# EAGLE design Cameras_2 (EAGLE 9.1.3)
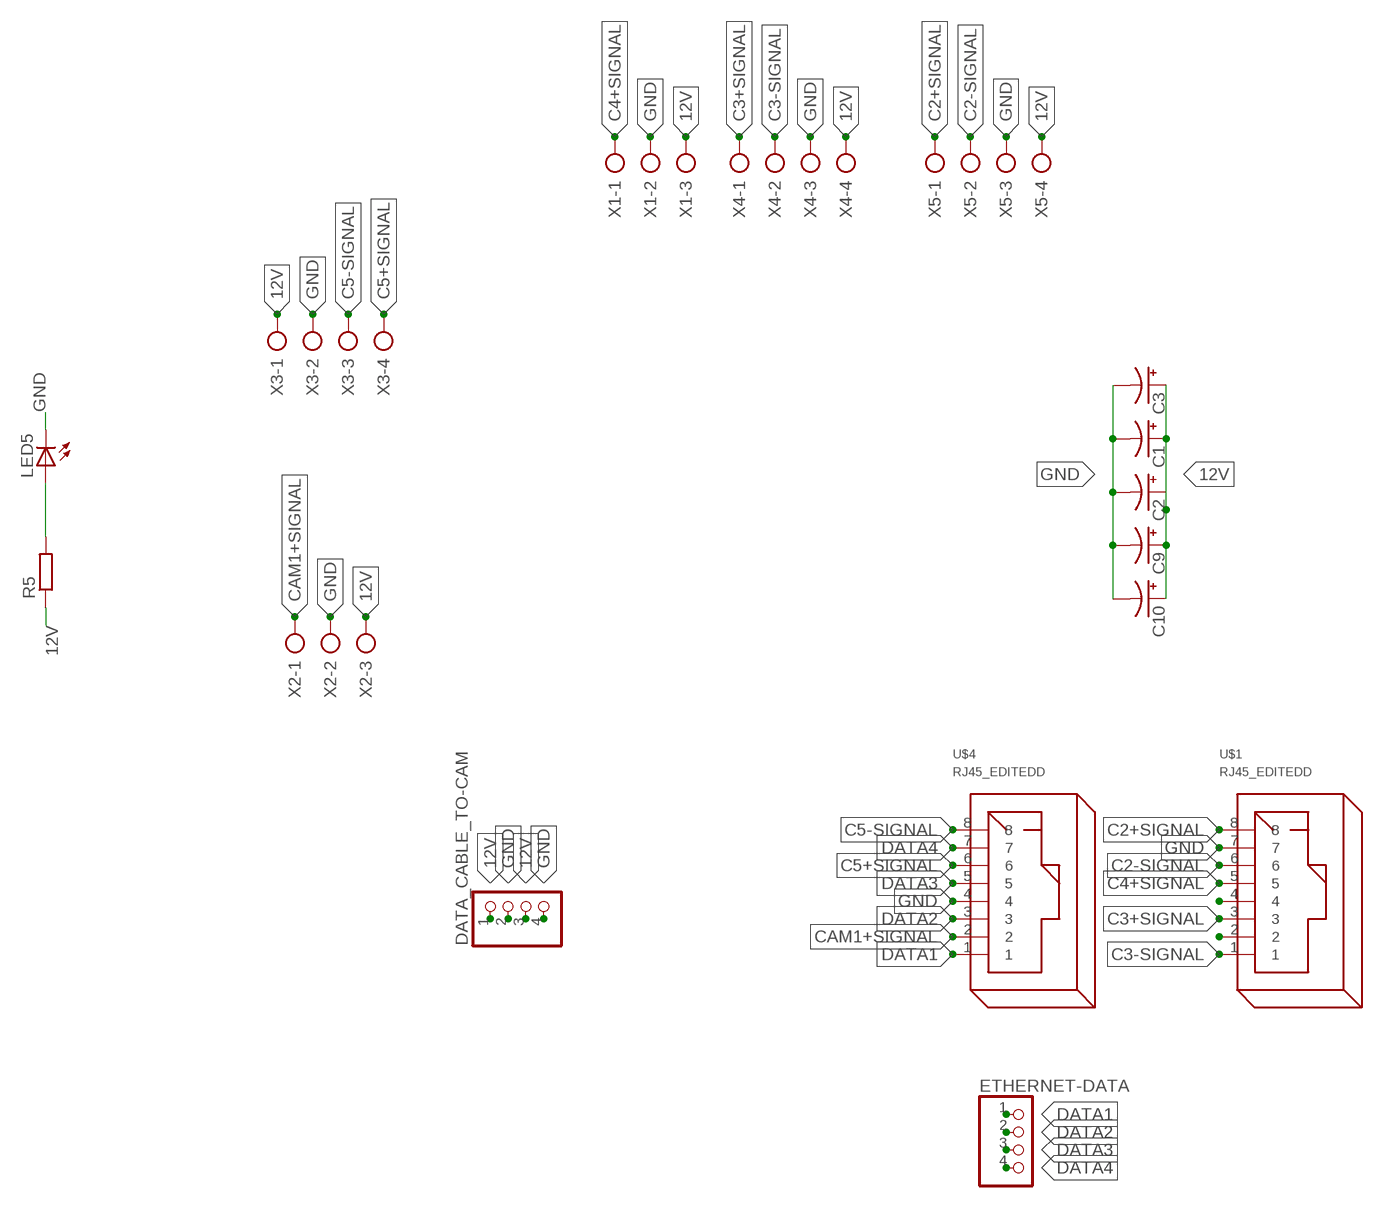
[diagram p0: schematic, sheet 1]

## Parts
C1  CPOL-USE2,5-6E  [E2,5-6E]
C2  CPOL-USE2,5-6E  [E2,5-6E]
C3  CPOL-USE2,5-6E  [E2,5-6E]
C9  CPOL-USE2,5-6E  [E2,5-6E]
C10  CPOL-USE2,5-6E  [E2,5-6E]
DATA_CABLE_TO-CAM  PINHD-1X4  [1X04]
ETHERNET-DATA  PINHD-1X4  [1X04]
LED5  LEDCHIPLED_1206  [CHIPLED_1206]
R5  R-EU_0204/7  [0204/7]
U$1  RJ45_EDITEDD  [RJ45]
U$4  RJ45_EDITEDD  [RJ45]
X1  AK300/3  [AK300/3]
X2  AK300/3  [AK300/3]
X3  AK300/4  [AK300/4]
X4  AK300/4  [AK300/4]
X5  AK300/4  [AK300/4]

## Nets
12V: C1.+ C2.+ C3.+ C9.+ C10.+ DATA_CABLE_TO-CAM.1 DATA_CABLE_TO-CAM.3 R5.1 X1.3 X2.3 X3.1 X4.4 X5.4
C2+SIGNAL: U$1.8 X5.1
C2-SIGNAL: U$1.6 X5.2
C3+SIGNAL: U$1.3 X4.1
C3-SIGNAL: U$1.1 X4.2
C4+SIGNAL: U$1.5 X1.1
C5+SIGNAL: U$4.6 X3.4
C5-SIGNAL: U$4.8 X3.3
CAM1+SIGNAL: U$4.2 X2.1
DATA1: ETHERNET-DATA.1 U$4.1
DATA2: ETHERNET-DATA.2 U$4.3
DATA3: ETHERNET-DATA.3 U$4.5
DATA4: ETHERNET-DATA.4 U$4.7
GND: C1.- C2.- C3.- C9.- C10.- DATA_CABLE_TO-CAM.2 DATA_CABLE_TO-CAM.4 LED5.C U$1.7 U$4.4 X1.2 X2.2 X3.2 X4.3 X5.3
N$10: LED5.A R5.2
N$26: U$1.4
N$28: U$1.2

## Library data of the parts
C1-C3 C9 C10 = rcl:CPOL-US: POLARIZED CAPACITOR, American symbol; SPICEPREFIX: C
DATA_CABLE_TO-CAM ETHERNET-DATA = pinhead:PINHD-1X4: PIN HEADER
LED5 = led:LED: LED OSRAM: - CHIPLED LG R971, LG N971, LY N971, LG Q971, LY Q971, LO R971, LY R971 LH N974, LH R974 LS Q976, LO Q976, LY Q976 LO Q996 - Hyper CHIPLED LW Q18S LB Q993, LB Q99A, LB R99A - SideLED LS A670, LO A670, LY A670, LG A670, LP A670 LB A673, LV A673, LT A673, LW A673 LH A674 LY A675 LS A676, LA A676, LO A676, LY A676, LW A676 LS A679, LY A679, LG A679 - Hyper Micro SIDELED® LS Y876, LA Y876, LO Y876, LY Y876 LT Y87S - SmartLED LW L88C, LW L88S LB L89C, LB L89S, LG L890 LS L89K, LO L89K, LY L89K LS L896, LA L896, LO L896, LY L896 - TOPLED LS T670, LO T670, LY T670, LG T670, LP T670 LSG T670, LSP T670, LSY T670, LOP T670, LYG T670 LG T671, LOG T671, LSG T671 LB T673, LV T673, LT T673, LW T673 LH T674 LS T676, LA T676, LO T676, LY T676, LB T676, LH T676, LSB T676, LW T676 LB T67C, LV T67C, LT T67C, LS T67K, LO T67K, LY T67K, LW E67C LS E67B, LA E67B, LO E67B, LY E67B, LB E67C, LV E67C, LT E67C LW T67C LS T679, LY T679, LG T679 LS T770, LO T770, LY T770, LG T770, LP T770 LB T773, LV T773, LT T773, LW T773 LH T774 LS E675, LA E675, LY E675, LS T675 LS T776, LA T776, LO T776, LY T776, LB T776 LHGB T686 LT T68C, LB T68C - Hyper Mini TOPLED® LB M676 - Mini TOPLED Santana® LG M470 LS M47K, LO M47K, LY M47K Source: http://www.osram.convergy.de LUXEON: - LUMILED® LXK2-PW12-R00, LXK2-PW12-S00, LXK2-PW14-U00, LXK2-PW14-V00 LXK2-PM12-R00, LXK2-PM12-S00, LXK2-PM14-U00 LXK2-PE12-Q00, LXK2-PE12-R00, LXK2-PE12-S00, LXK2-PE14-T00, LXK2-PE14-U00 LXK2-PB12-K00, LXK2-PB12-L00, LXK2-PB12-M00, LXK2-PB14-N00, LXK2-PB14-P00, LXK2-PB14-Q00 LXK2-PR12-L00, LXK2-PR12-M00, LXK2-PR14-Q00, LXK2-PR14-R00 LXK2-PD12-Q00, LXK2-PD12-R00, LXK2-PD12-S00 LXK2-PH12-R00, LXK2-PH12-S00 LXK2-PL12-P00, LXK2-PL12-Q00, LXK2-PL12-R00 Source: www.luxeon.com KINGBRIGHT: KA-3528ASYC Source: www.kingbright.com
R5 = rcl:R-EU_: RESISTOR, European symbol; SPICEPREFIX: R
U$1 U$4 = RJ45_EDITEDD:RJ45_EDITEDD
X1 X2 = con-ptr500:AK300/3: CONNECTOR; OC_FARNELL: unknown; OC_NEWARK: unknown
X3-X5 = con-ptr500:AK300/4: CONNECTOR; OC_FARNELL: unknown; OC_NEWARK: unknown

## Board
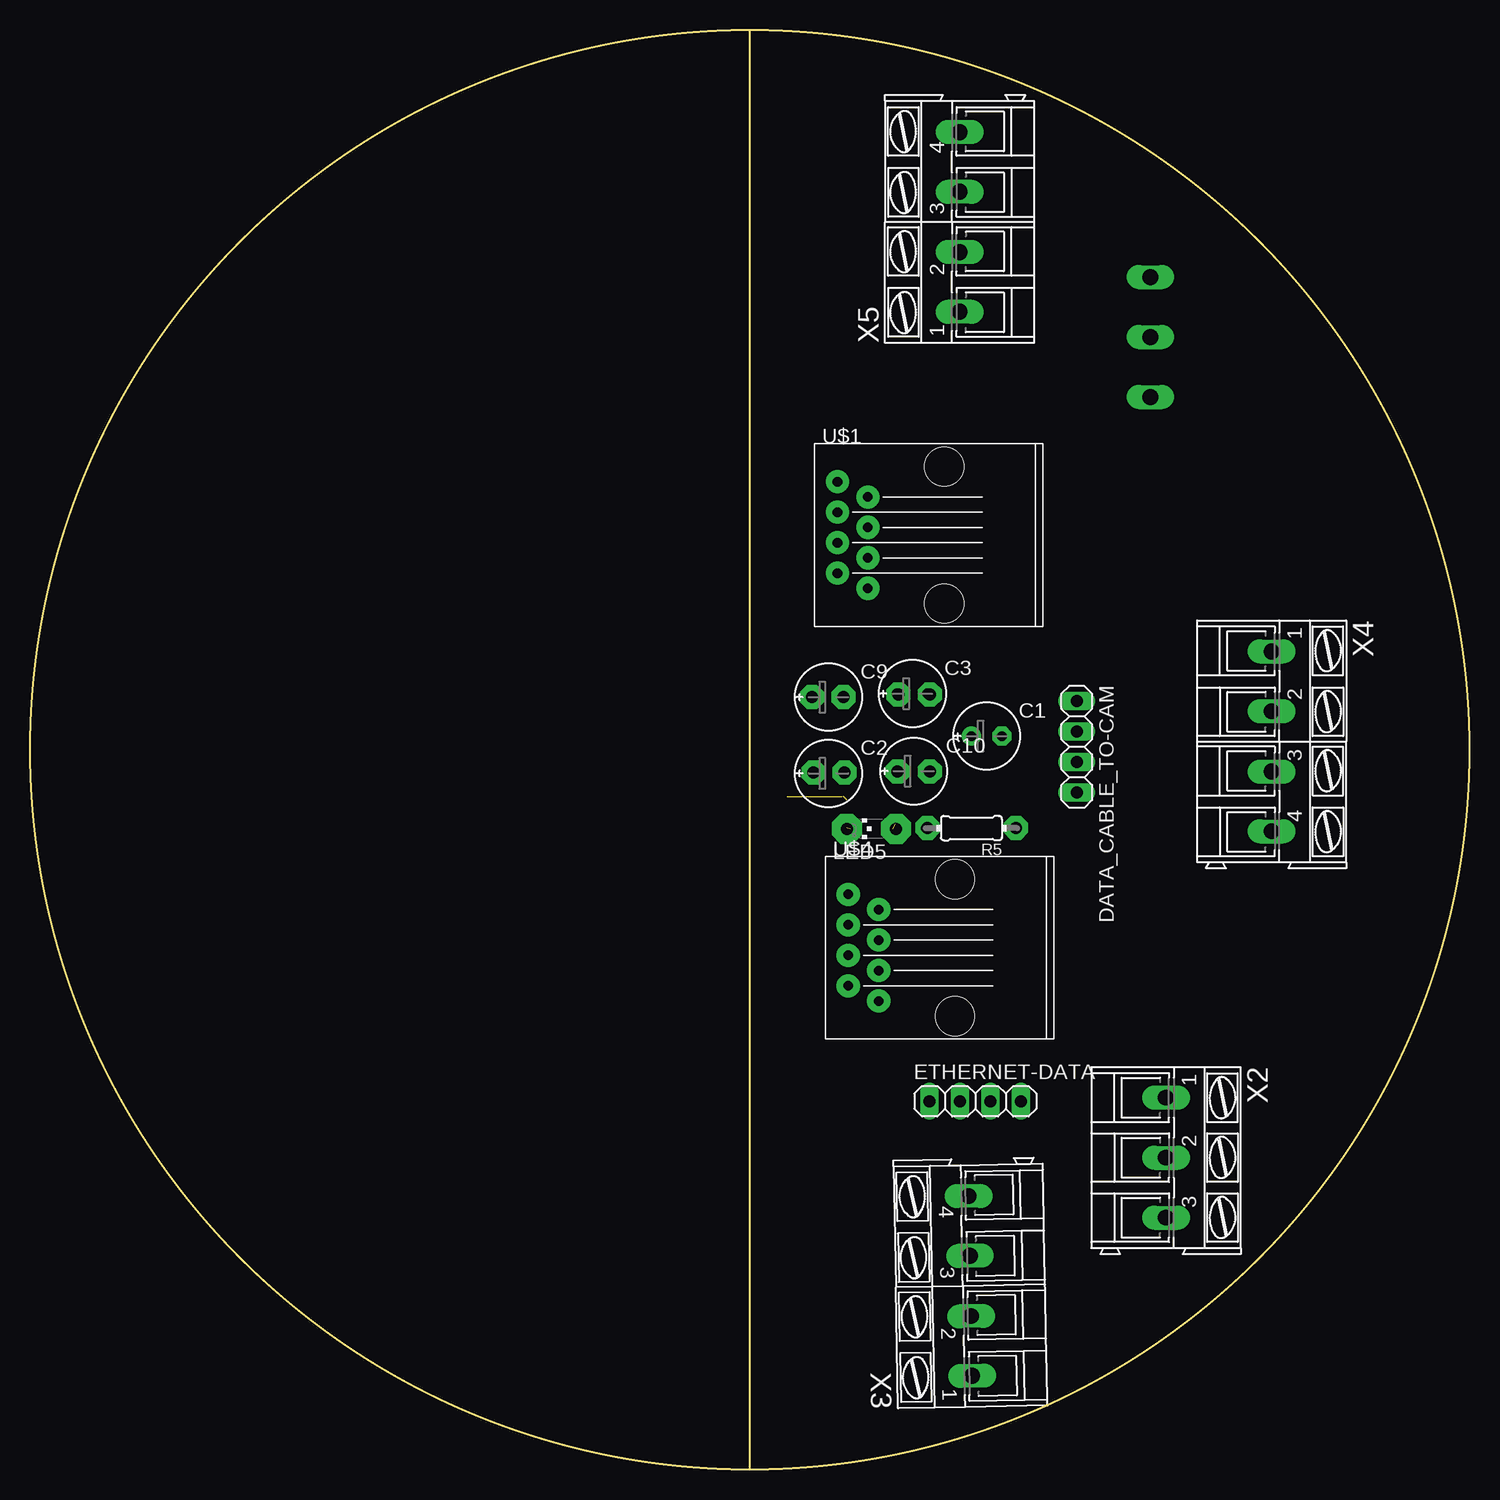
[diagram p1: board, top side]
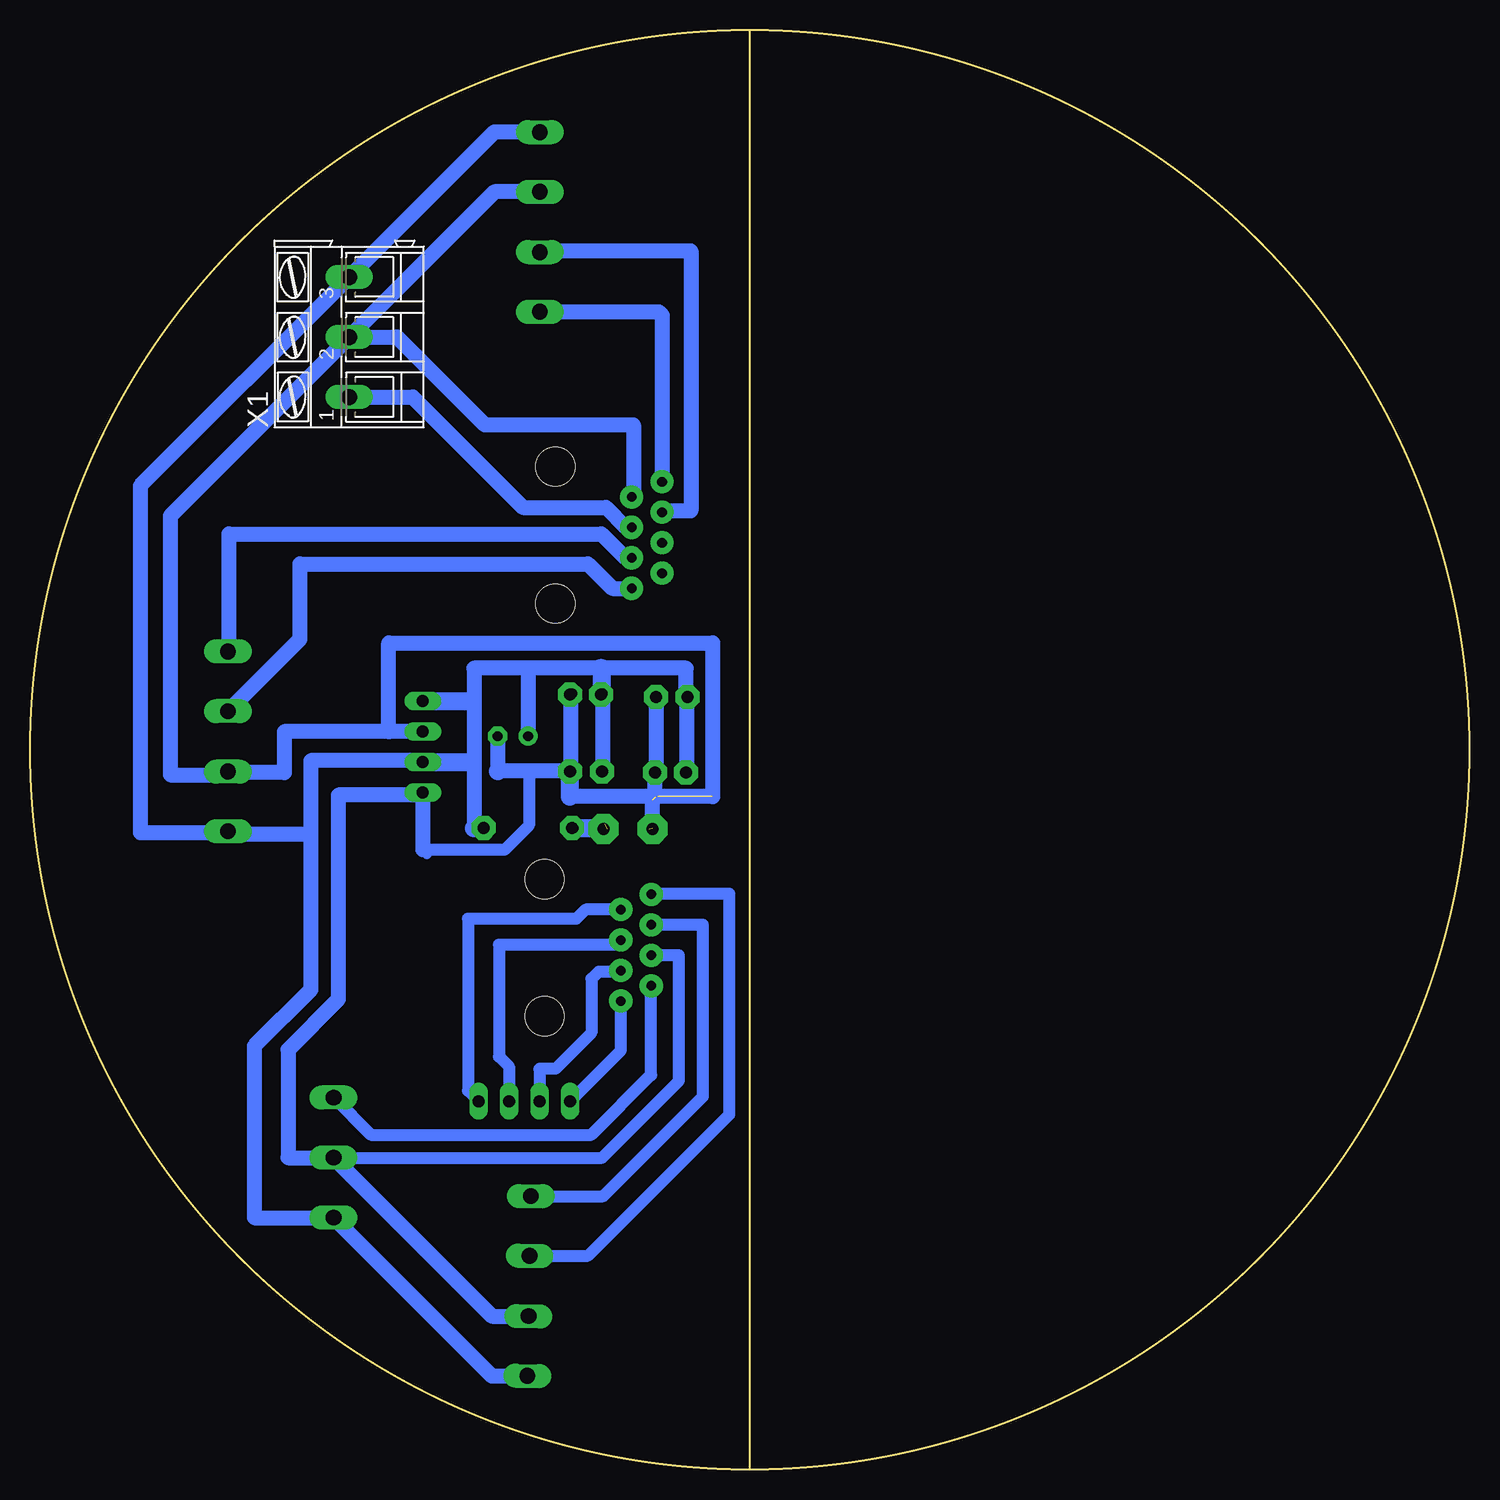
[diagram p2: board, bottom side, seen from below]

Size 120 x 120 mm. Coordinates in mm from the lower left corner, seen from the top.
Outline: 60,0 60,120
Outline: circle at 60,60 radius 60
Copper layers (1*16): Top 0.035mm / dielectric 1.5mm / Bottom 0.035mm
Design rules "default": minimum track width 6mil, minimum drill 0.35mm, track to track 6mil, track to pad 6mil, pad to pad 6mil, via to via 6mil, smd to smd 6mil, copper to edge 40mil, drill to drill 6mil, minimum pad ring 10mil, minimum via ring 8mil, stop-mask expansion 4mil, vias tented up to drill 0mil, thermal gap 10mil

### Footprints (pad centres in the part's own frame; a part is rotated, then mirrored left to right if it is on the bottom)
E2,5-6E = drill 0.813 pad 1.575: + -1.27,0 | drill 0.813 pad 1.575 octagon: - 1.27,0
1X04 = drill 1.016 long: 1 -3.81,0; 2 -1.27,0; 3 1.27,0; 4 3.81,0
CHIPLED_1206 = smd 1.5 x 1.5: A 0,-1.75; C 0,1.75
0204/7 = drill 0.813 octagon: 1 -3.81,0; 2 3.81,0
RJ45 = drill 0.8 pad 1.93: 1 -6.35,-4.445; 2 -8.89,-3.175; 3 -6.35,-1.905; 4 -8.89,-0.635; 5 -6.35,0.635; 6 -8.89,1.905; 7 -6.35,3.175; 8 -8.89,4.445 | hole 3.25: 0,-5.715; 0,5.715
AK300/3 = drill 1.321 long: 1 -5.004,0; 2 0,0; 3 5.004,0
AK300/4 = drill 1.321 long: 1 -7.493,0; 2 -2.515,0; 3 2.515,0; 4 7.493,0

### Placement (x,y rotation side)
C1  79.75,61.13 0 top
C2  66.56,58.03 0 top
C3  73.55,64.68 0 top
C9  66.56,64.38 0 top
C10  73.67,58.21 0 top
DATA_CABLE_TO-CAM  87.26,60.24 270 top
ETHERNET-DATA  78.8,30.7 0 top
LED5  70.13,53.41 90 top
R5  78.48,53.46 180 top
U$1  76.2,77.9 0 top
U$4  77.1,43.5 0 top
X1  93.4,94.4 90 bottom
X2  94.7,26 270 top
X3  78.4,15.3 91.1 top
X4  103.5,60.7 270 top
X5  77.5,104 90 top

### Tracks (layer width: path | path; a pad name or v marks a point on that pad's centre or on a via)
12V
  Bottom 0.813: 72.28,58.33 C10.+ | C3.+ 72.3,64.7 | 78.5,61.15 C1.+ | C9.+ | 83.15,64.05 83,64.2 | 83.07,58.97 83,58.9
  Bottom 1.016: DATA_CABLE_TO-CAM.3 87.39,59.1 | 103.29,53 X4.4 103.61,53.1
  Bottom 1.27: C9.+ C2.+ | C3.+ 72.28,58.33 | 72.5,66.8 78.5,66.8 | 78.5,66.8 78.5,61.15 | C9.+ 65.3,66.8 72.3,66.8 | 78.5,66.8 83,66.8 83,64.2 83,58.9 83,53.46 | 87.39,59.1 96.6,59.1 96.6,53 | 96.6,53 96.6,40 101.3,35.3 101.3,21 X2.3 81.51,7.81 X3.1 | 103.29,53 96.6,53 | 103.61,53.1 110.8,53.1 110.8,82 X1.3 81.31,111.49 X5.4
  Bottom 1.5: 72.3,64.7 72.3,66.8 72.5,66.8 | 83,53.46 R5.1 | DATA_CABLE_TO-CAM.1 83.15,64.05 | DATA_CABLE_TO-CAM.3 83.07,58.97
C2+SIGNAL
  Bottom 1.27: X5.1 67.59,96.51 67.3,96.21 67.3,82.36 U$1.8
C2-SIGNAL
  Bottom 1.27: U$1.6 67.22,79.9 64.9,79.9 64.9,101.6 77.39,101.6 X5.2
C3+SIGNAL
  Bottom 1.27: X4.1 103.4,68.29 103.4,78 72.36,78 70.35,76 U$1.3
C3-SIGNAL
  Bottom 1.27: X4.2 97.5,69.22 97.5,75.5 73.5,75.5 71.45,73.45 U$1.1
C4+SIGNAL
  Bottom 1.27: X1.1 88.1,89.4 78.9,80.2 72,80.2 70.34,78.53 U$1.5
C5+SIGNAL
  Bottom 1.016: X3.4 72.21,22.79 63.9,31.1 63.9,45.4 U$4.6
C5-SIGNAL
  Bottom 1.016: X3.3 73.49,17.81 61.7,29.6 61.7,48 68.16,48 U$4.8
CAM1+SIGNAL
  Bottom 1.016: X2.1 91.6,27.9 73.2,27.9 68.21,32.89 U$4.2
DATA1
  Bottom 0.813: U$4.1 70.39,38.7
  Bottom 1.016: ETHERNET-DATA.1 70.75,34.94 U$4.1
DATA2
  Bottom 1.016: U$4.3 70.84,41.5 72.6,41.5 73.2,40.9 73.2,36.4 76.2,33.4 77.5,33.4 77.53,33.37 ETHERNET-DATA.2
DATA3
  Bottom 1.016: U$4.5 71.15,43.73 80.9,43.73 80.9,34.43 80.07,33.6 ETHERNET-DATA.3
DATA4
  Bottom 1.016: U$4.7 73.69,46.67 74.46,45.9 83.5,45.9 83.5,31.59 ETHERNET-DATA.4
GND  (via drill 1 pad 2)  (3 unrouted)
  Bottom 0.813: C3.- 74.94,64.56 | 81.02,58.22 80.8,58 | v75,58.2 C10.- | C10.- | 67.93,56.5 68.1,56.5 67.7,56.1 67.8,56.1 | 75,58.15 C10.- | 90.09,61.51 90.1,61.5 | 90.09,68.89 90.1,68.9 | C2.- 67.93,57.93 | 87.26,51.66 86.9,51.3
  Bottom 1.016: DATA_CABLE_TO-CAM.4 87.47,56.22 | X2.2 72.3,26 65.9,32.4 65.9,42.86 U$4.4 | 78.4,58.21 78.4,53.7 80.44,51.66 87.26,51.66 | 98.81,61.51 98.8,61.5 | 104,58 103.9,58.1 103.81,58.19 X4.3 103.78,57.9
  Bottom 1.27: C9.- C2.- | 74.94,64.56 C10.- 78.4,58.21 81.01,58.21 | C1.- 81.02,58.22 | 67.93,57.93 67.93,56.5 | 75,56.1 63.1,56.1 63.1,68.9 90.1,68.9 | 68.1,53.5 68.1,55.8 | DATA_CABLE_TO-CAM.4 87.26,51.66 | DATA_CABLE_TO-CAM.2 90.09,61.51 | 90.09,61.51 90.09,68.89 | 87.47,56.22 94.3,56.22 94.3,39.2 98.5,35 98.5,26 X2.2 81.49,12.79 X3.2 | 90.09,61.51 98.81,61.51 | 98.8,61.5 98.8,58.1 103.9,58.1 | 103.78,57.9 108.3,57.9 108.3,79.5 X1.2 | X5.3 81.28,106.52 X1.2 | X1.2 89.4,94.4 82.1,87.1 69.7,87.1 69.7,81.22 U$1.7
  Bottom 1.5: 75,56.1 75,58.15 | 81.01,58.21 81.02,58.22
N$10  (1 unrouted)
  Bottom 0.813: 72.44,53.46 72.1,53.8
  Bottom 1.5: R5.2 72.44,53.46
N$30  (via drill 1 pad 2.5)
  other vias: 68.1,53.4
N$31  (via drill 1 pad 2.5)
  other vias: 72.2,53.4
N$32  (via drill 1 pad 2)
  other vias: 74.8,53.5
N$33  (via drill 1 pad 2)
  other vias: 82.2,53.5
N$34  (via drill 1 pad 2)
  other vias: 65.2,64.4
N$35  (via drill 1 pad 2)
  other vias: 67.8,64.4
N$36  (via drill 1 pad 2)
  other vias: 72.4,64.6
N$37  (via drill 1 pad 2)
  other vias: 75,64.6
N$38  (via drill 1 pad 2)
  other vias: 65.3,58.1
N$39  (via drill 1 pad 2)
  other vias: 67.9,58.1
N$40  (via drill 1 pad 2)
  other vias: 72.3,58.2

### Text on the board
BD-Top: 12V | 12V | GND | GND | 12V | 12V | GND | GND | GND | GND | 12V | 12V | GND | GND | 12V | 12V | GND | GND | 12V | 12V